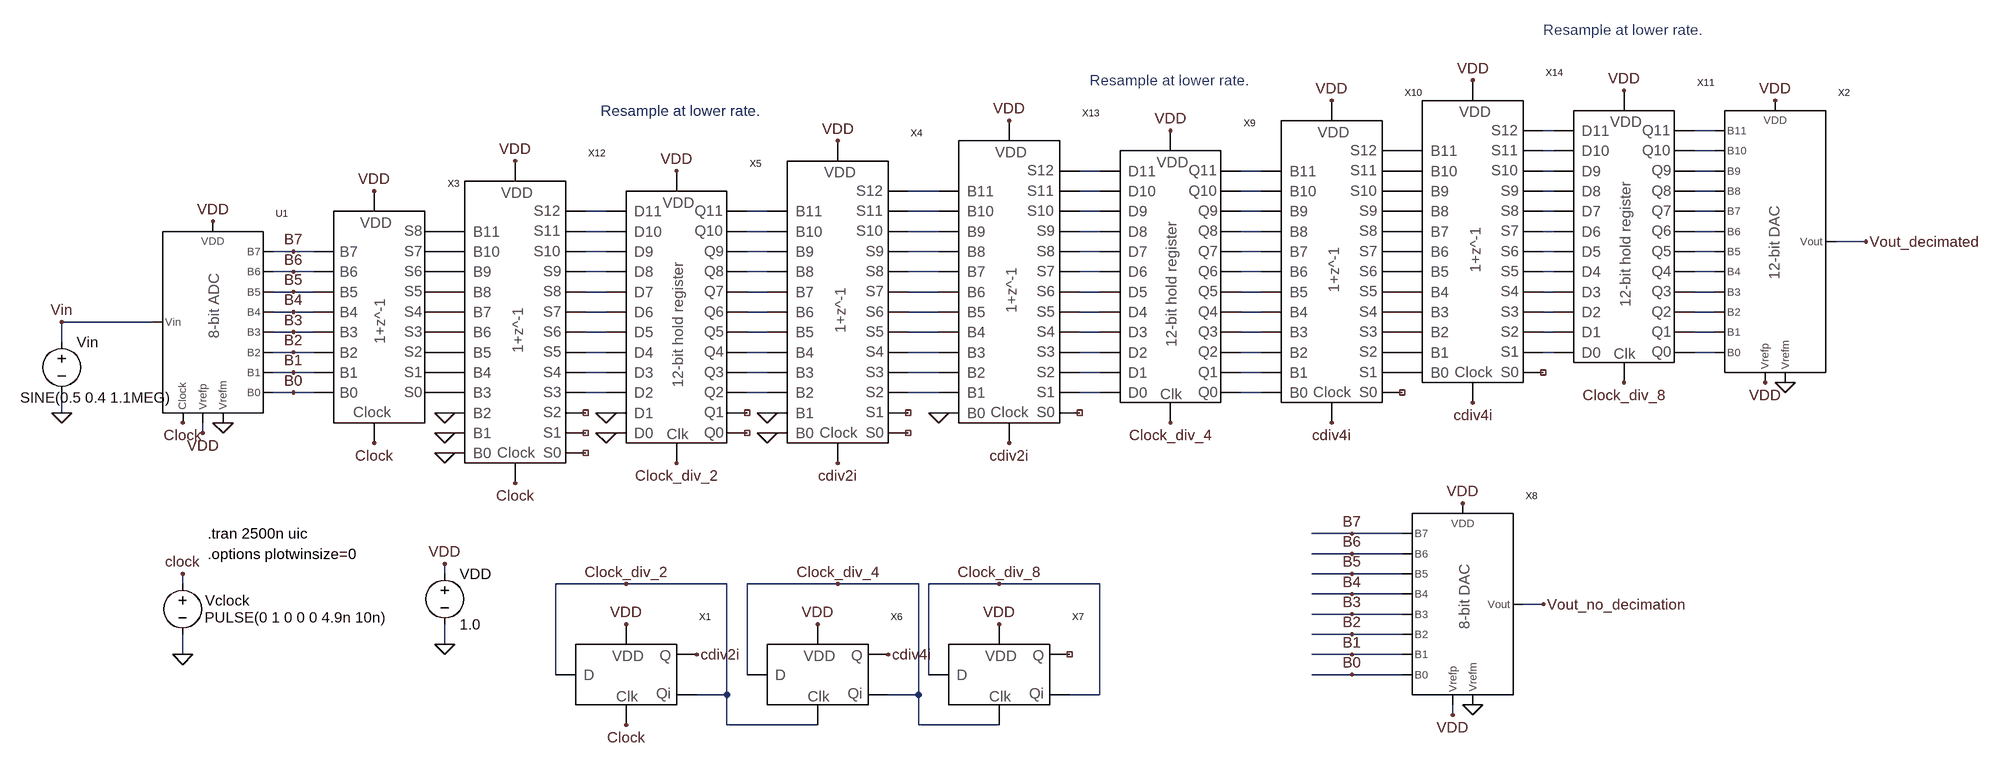
[diagram p0: schematic _Fig4_34_L=2_MSD.asc]
_Fig4_34_L=2_MSD.asc, the LTspice schematic file:
Version 4
SHEET 1 4244 1116
WIRE 3088 -864 3072 -864
WIRE 3344 -864 3312 -864
WIRE 3088 -832 3072 -832
WIRE 3344 -832 3312 -832
WIRE 2368 -800 2336 -800
WIRE 2624 -800 2592 -800
WIRE 3088 -800 3072 -800
WIRE 3344 -800 3312 -800
WIRE 2112 -768 2064 -768
WIRE 2368 -768 2336 -768
WIRE 2624 -768 2592 -768
WIRE 3088 -768 3072 -768
WIRE 3344 -768 3312 -768
WIRE 1584 -736 1552 -736
WIRE 1840 -736 1808 -736
WIRE 2112 -736 2064 -736
WIRE 2368 -736 2336 -736
WIRE 2624 -736 2592 -736
WIRE 3088 -736 3072 -736
WIRE 3344 -736 3312 -736
WIRE 1584 -704 1552 -704
WIRE 1840 -704 1808 -704
WIRE 2112 -704 2064 -704
WIRE 2368 -704 2336 -704
WIRE 2624 -704 2592 -704
WIRE 3088 -704 3072 -704
WIRE 3344 -704 3312 -704
WIRE 3584 -688 3536 -688
WIRE 1088 -672 1056 -672
WIRE 1120 -672 1088 -672
WIRE 1584 -672 1552 -672
WIRE 1840 -672 1808 -672
WIRE 2112 -672 2064 -672
WIRE 2368 -672 2336 -672
WIRE 2624 -672 2592 -672
WIRE 3088 -672 3072 -672
WIRE 3344 -672 3312 -672
WIRE 1088 -640 1056 -640
WIRE 1120 -640 1088 -640
WIRE 1584 -640 1552 -640
WIRE 1840 -640 1808 -640
WIRE 2112 -640 2064 -640
WIRE 2368 -640 2336 -640
WIRE 2624 -640 2592 -640
WIRE 3088 -640 3072 -640
WIRE 3344 -640 3312 -640
WIRE 1088 -608 1056 -608
WIRE 1120 -608 1088 -608
WIRE 1584 -608 1552 -608
WIRE 1840 -608 1808 -608
WIRE 2112 -608 2064 -608
WIRE 2368 -608 2336 -608
WIRE 2624 -608 2592 -608
WIRE 3088 -608 3072 -608
WIRE 3344 -608 3312 -608
WIRE 1088 -576 1056 -576
WIRE 1120 -576 1088 -576
WIRE 1584 -576 1552 -576
WIRE 1840 -576 1808 -576
WIRE 2112 -576 2064 -576
WIRE 2368 -576 2336 -576
WIRE 2624 -576 2592 -576
WIRE 3088 -576 3072 -576
WIRE 3344 -576 3312 -576
WIRE 864 -560 720 -560
WIRE 1088 -544 1056 -544
WIRE 1120 -544 1088 -544
WIRE 1584 -544 1552 -544
WIRE 1840 -544 1808 -544
WIRE 2112 -544 2064 -544
WIRE 2368 -544 2336 -544
WIRE 2624 -544 2592 -544
WIRE 3088 -544 3072 -544
WIRE 3344 -544 3312 -544
WIRE 720 -528 720 -560
WIRE 1088 -512 1056 -512
WIRE 1120 -512 1088 -512
WIRE 1584 -512 1552 -512
WIRE 1840 -512 1808 -512
WIRE 2112 -512 2064 -512
WIRE 2368 -512 2336 -512
WIRE 2624 -512 2592 -512
WIRE 3088 -512 3072 -512
WIRE 3344 -512 3312 -512
WIRE 1088 -480 1056 -480
WIRE 1120 -480 1088 -480
WIRE 1584 -480 1552 -480
WIRE 1840 -480 1808 -480
WIRE 2112 -480 2064 -480
WIRE 2368 -480 2336 -480
WIRE 2624 -480 2592 -480
WIRE 1088 -448 1056 -448
WIRE 1120 -448 1088 -448
WIRE 1584 -448 1552 -448
WIRE 1840 -448 1808 -448
WIRE 2112 -448 2064 -448
WIRE 2368 -448 2336 -448
WIRE 2624 -448 2592 -448
WIRE 720 -416 720 -448
WIRE 944 -384 944 -400
WIRE 2768 -224 2704 -224
WIRE 2848 -224 2768 -224
WIRE 2768 -192 2704 -192
WIRE 2848 -192 2768 -192
WIRE 1328 -160 1328 -176
WIRE 2768 -160 2704 -160
WIRE 2848 -160 2768 -160
WIRE 912 -144 912 -160
WIRE 1616 -144 1504 -144
WIRE 1776 -144 1616 -144
WIRE 1952 -144 1808 -144
WIRE 2080 -144 1952 -144
WIRE 2208 -144 2096 -144
WIRE 2368 -144 2208 -144
WIRE 2768 -128 2704 -128
WIRE 2848 -128 2768 -128
WIRE 3072 -112 3040 -112
WIRE 2768 -96 2704 -96
WIRE 2848 -96 2768 -96
WIRE 2768 -64 2704 -64
WIRE 2848 -64 2768 -64
WIRE 1328 -48 1328 -80
WIRE 912 -32 912 -64
WIRE 2768 -32 2704 -32
WIRE 2848 -32 2768 -32
WIRE 1504 0 1504 -144
WIRE 1808 0 1808 -144
WIRE 2096 0 2096 -144
WIRE 2768 0 2704 0
WIRE 2848 0 2768 0
WIRE 1776 32 1776 -144
WIRE 1776 32 1728 32
WIRE 2080 32 2080 -144
WIRE 2080 32 2032 32
WIRE 2368 32 2368 -144
WIRE 2368 32 2320 32
WIRE 2928 64 2928 48
WIRE 1776 80 1776 32
WIRE 1920 80 1776 80
WIRE 2080 80 2080 32
WIRE 2208 80 2080 80
FLAG 720 -416 0
FLAG 720 -560 Vin
FLAG 912 -32 0
FLAG 912 -160 clock
FLAG 1328 -48 0
FLAG 1328 -176 VDD
FLAG 3584 -688 Vout_decimated
FLAG 3440 -912 VDD
FLAG 3456 -464 0
FLAG 1088 -672 B7
FLAG 1088 -640 B6
FLAG 1088 -608 B5
FLAG 1088 -576 B4
FLAG 1088 -544 B3
FLAG 1088 -512 B2
FLAG 1088 -480 B1
FLAG 1088 -448 B0
FLAG 960 -720 VDD
FLAG 976 -400 0
FLAG 944 -384 VDD
FLAG 3424 -464 VDD
FLAG 1216 -768 VDD
FLAG 1216 -368 Clock
FLAG 1616 -80 VDD
FLAG 1616 80 Clock
FLAG 1920 -80 VDD
FLAG 2208 -80 VDD
FLAG 2208 -144 Clock_div_8
FLAG 2768 -224 B7
FLAG 2768 -192 B6
FLAG 2768 -160 B5
FLAG 2768 -128 B4
FLAG 2768 -96 B3
FLAG 2768 -64 B2
FLAG 2768 -32 B1
FLAG 2768 0 B0
FLAG 2960 48 0
FLAG 2928 64 VDD
FLAG 3072 -112 Vout_no_decimation
FLAG 912 -400 Clock
FLAG 1952 -144 Clock_div_4
FLAG 1616 -144 Clock_div_2
FLAG 1840 -416 0
FLAG 1840 -384 0
FLAG 1952 -848 VDD
FLAG 1696 -800 VDD
FLAG 1584 -384 0
FLAG 2480 -864 VDD
FLAG 2736 -912 VDD
FLAG 3200 -928 VDD
FLAG 2944 -272 VDD
FLAG 1696 -336 Clock_div_2
FLAG 2480 -400 Clock_div_4
FLAG 3200 -464 Clock_div_8
FLAG 1728 -32 cdiv2i
FLAG 1952 -336 cdiv2i
FLAG 2736 -400 cdiv4i
FLAG 2032 -32 cdiv4i
FLAG 1328 -416 0
FLAG 1328 -384 0
FLAG 1328 -352 0
FLAG 1440 -816 VDD
FLAG 1440 -304 Clock
FLAG 2112 -416 0
FLAG 2224 -880 VDD
FLAG 2224 -368 cdiv2i
FLAG 2960 -944 VDD
FLAG 2960 -432 cdiv4i
FLAG 1584 -416 0
SYMBOL voltage 720 -544 R0
WINDOW 123 0 0 Left 0
WINDOW 39 0 0 Left 0
WINDOW 3 -66 104 Left 0
SYMATTR Value SINE(0.5 0.4 1.1MEG)
SYMATTR InstName Vin
SYMBOL voltage 912 -160 R0
WINDOW 0 36 42 Left 0
WINDOW 3 35 69 Left 0
WINDOW 123 0 0 Left 0
WINDOW 39 0 0 Left 0
SYMATTR InstName Vclock
SYMATTR Value PULSE(0 1 0 0 0 4.9n 10n)
SYMBOL voltage 1328 -176 R0
WINDOW 123 0 0 Left 0
WINDOW 39 0 0 Left 0
SYMATTR InstName VDD
SYMATTR Value 1.0
SYMBOL Ideal_8_bit_ADC 880 -416 R0
SYMATTR InstName U1
SYMBOL Ideal_12_bit_DAC 3360 -480 R0
SYMATTR InstName X2
SYMBOL DFF 1536 48 R0
SYMATTR InstName X1
SYMBOL DFF 1840 48 R0
SYMATTR InstName X6
SYMBOL DFF 2128 48 R0
SYMATTR InstName X7
SYMBOL Ideal_8_bit_DAC 2864 32 R0
SYMATTR InstName X8
SYMBOL 12_bit_register 1616 -368 R0
SYMATTR InstName X5
SYMBOL 8_bit_averager 1152 -400 R0
SYMATTR InstName X3
SYMBOL 12_bit_averager 1872 -368 R0
SYMATTR InstName X4
SYMBOL 12_bit_register 2400 -432 R0
SYMATTR InstName X9
SYMBOL 12_bit_averager 2656 -432 R0
SYMATTR InstName X10
SYMBOL 12_bit_register 3120 -496 R0
SYMATTR InstName X11
SYMBOL 12_bit_averager 1360 -336 R0
SYMATTR InstName X12
SYMBOL 12_bit_averager 2144 -400 R0
SYMATTR InstName X13
SYMBOL 12_bit_averager 2880 -464 R0
SYMATTR InstName X14
TEXT 952 -224 Left 0 !.tran 2500n uic
TEXT 952 -192 Left 0 !.options plotwinsize=0
TEXT 1576 -896 Left 0 ;Resample at lower rate.
TEXT 1576 -896 Left 0 ;Resample at lower rate.
TEXT 2352 -944 Left 0 ;Resample at lower rate.
TEXT 3072 -1024 Left 0 ;Resample at lower rate.

The netlist it stands for:
* _Fig4_34_L=2_MSD.asc
Vin Vin 0 SINE(0.5 0.4 1.1MEG)
Vclock clock 0 PULSE(0 1 0 0 0 4.9n 10n)
VDD VDD 0 1.0
XU1 B7 B6 B5 B4 B3 B2 B1 B0 Vin VDD 0 clock VDD Ideal_8_bit_ADC  ; pins B7 B6 B5 B4 B3 B2 B1 B0 Vin Vrefp Vrefm Clock VDD
XX2 N002 N004 N008 N013 N020 N027 N034 N041 N048 N055 N062 N069 Vout_decimated VDD 0 VDD Ideal_12_bit_DAC  ; pins B11 B10 B9 B8 B7 B6 B5 B4 B3 B2 B1 B0 Vout Vrefp Vrefm VDD
XX1 Clock_div_2 clock cdiv2i Clock_div_2 VDD DFF  ; pins D Clk Q Qi VDD
XX6 Clock_div_4 Clock_div_2 cdiv4i Clock_div_4 VDD DFF  ; pins D Clk Q Qi VDD
XX7 Clock_div_8 Clock_div_4 NC_01 Clock_div_8 VDD DFF  ; pins D Clk Q Qi VDD
XX8 B7 B6 B5 B4 B3 B2 B1 B0 Vout_no_decimation VDD 0 VDD Ideal_8_bit_DAC  ; pins B7 B6 B5 B4 B3 B2 B1 B0 Vout Vrefp Vrefm VDD
XX5 0 0 N075 N070 N063 N056 N049 N042 N035 N028 N021 N014 NC_02 NC_03 N076 N071 N064 N057 N050 N043 N036 N029 N022 N015 Clock_div_2 VDD 12_bit_register  ; pins D0 D1 D2 D3 D4 D5 D6 D7 D8 D9 D10 D11 Q0 Q1 Q2 Q3 Q4 Q5 Q6 Q7 Q8 Q9 Q10 Q11 Clk VDD
XX3 B0 B1 B2 B3 B4 B5 B6 B7 P001 P002 P003 P004 P005 P006 P007 P008 P009 clock VDD 8_bit_averager  ; pins B0 B1 B2 B3 B4 B5 B6 B7 S0 S1 S2 S3 S4 S5 S6 S7 S8 Clock VDD
XX4 0 0 N076 N071 N064 N057 N050 N043 N036 N029 N022 N015 NC_04 NC_05 N077 N072 N065 N058 N051 N044 N037 N030 N023 N016 N009 cdiv2i VDD 12_bit_averager  ; pins B0 B1 B2 B3 B4 B5 B6 B7 B8 B9 B10 B11 S0 S1 S2 S3 S4 S5 S6 S7 S8 S9 S10 S11 S12 Clock VDD
XX9 N078 N073 N066 N059 N052 N045 N038 N031 N024 N017 N010 N005 N079 N074 N067 N060 N053 N046 N039 N032 N025 N018 N011 N006 Clock_div_4 VDD 12_bit_register  ; pins D0 D1 D2 D3 D4 D5 D6 D7 D8 D9 D10 D11 Q0 Q1 Q2 Q3 Q4 Q5 Q6 Q7 Q8 Q9 Q10 Q11 Clk VDD
XX10 N079 N074 N067 N060 N053 N046 N039 N032 N025 N018 N011 N006 NC_06 P010 P011 P012 P013 P014 P015 P016 P017 P018 P019 P020 P021 cdiv4i VDD 12_bit_averager  ; pins B0 B1 B2 B3 B4 B5 B6 B7 B8 B9 B10 B11 S0 S1 S2 S3 S4 S5 S6 S7 S8 S9 S10 S11 S12 Clock VDD
XX11 N068 N061 N054 N047 N040 N033 N026 N019 N012 N007 N003 N001 N069 N062 N055 N048 N041 N034 N027 N020 N013 N008 N004 N002 Clock_div_8 VDD 12_bit_register  ; pins D0 D1 D2 D3 D4 D5 D6 D7 D8 D9 D10 D11 Q0 Q1 Q2 Q3 Q4 Q5 Q6 Q7 Q8 Q9 Q10 Q11 Clk VDD
XX12 0 0 0 P001 P002 P003 P004 P005 P006 P007 P008 P009 NC_07 NC_08 NC_09 N075 N070 N063 N056 N049 N042 N035 N028 N021 N014 clock VDD 12_bit_averager  ; pins B0 B1 B2 B3 B4 B5 B6 B7 B8 B9 B10 B11 S0 S1 S2 S3 S4 S5 S6 S7 S8 S9 S10 S11 S12 Clock VDD
XX13 0 N077 N072 N065 N058 N051 N044 N037 N030 N023 N016 N009 NC_10 N078 N073 N066 N059 N052 N045 N038 N031 N024 N017 N010 N005 cdiv2i VDD 12_bit_averager  ; pins B0 B1 B2 B3 B4 B5 B6 B7 B8 B9 B10 B11 S0 S1 S2 S3 S4 S5 S6 S7 S8 S9 S10 S11 S12 Clock VDD
XX14 P010 P011 P012 P013 P014 P015 P016 P017 P018 P019 P020 P021 NC_11 N068 N061 N054 N047 N040 N033 N026 N019 N012 N007 N003 N001 cdiv4i VDD 12_bit_averager  ; pins B0 B1 B2 B3 B4 B5 B6 B7 B8 B9 B10 B11 S0 S1 S2 S3 S4 S5 S6 S7 S8 S9 S10 S11 S12 Clock VDD
.tran 2500n uic
.options plotwinsize=0
* Resample at lower rate.
* Resample at lower rate.
* Resample at lower rate.
* Resample at lower rate.
.backanno
.end